# Altium schematic sheet LAN9254_C_P1.SchDoc
size 431 x 279 mm; DocumentNumber: 14; SheetNumber: 8; SheetTotal: 13
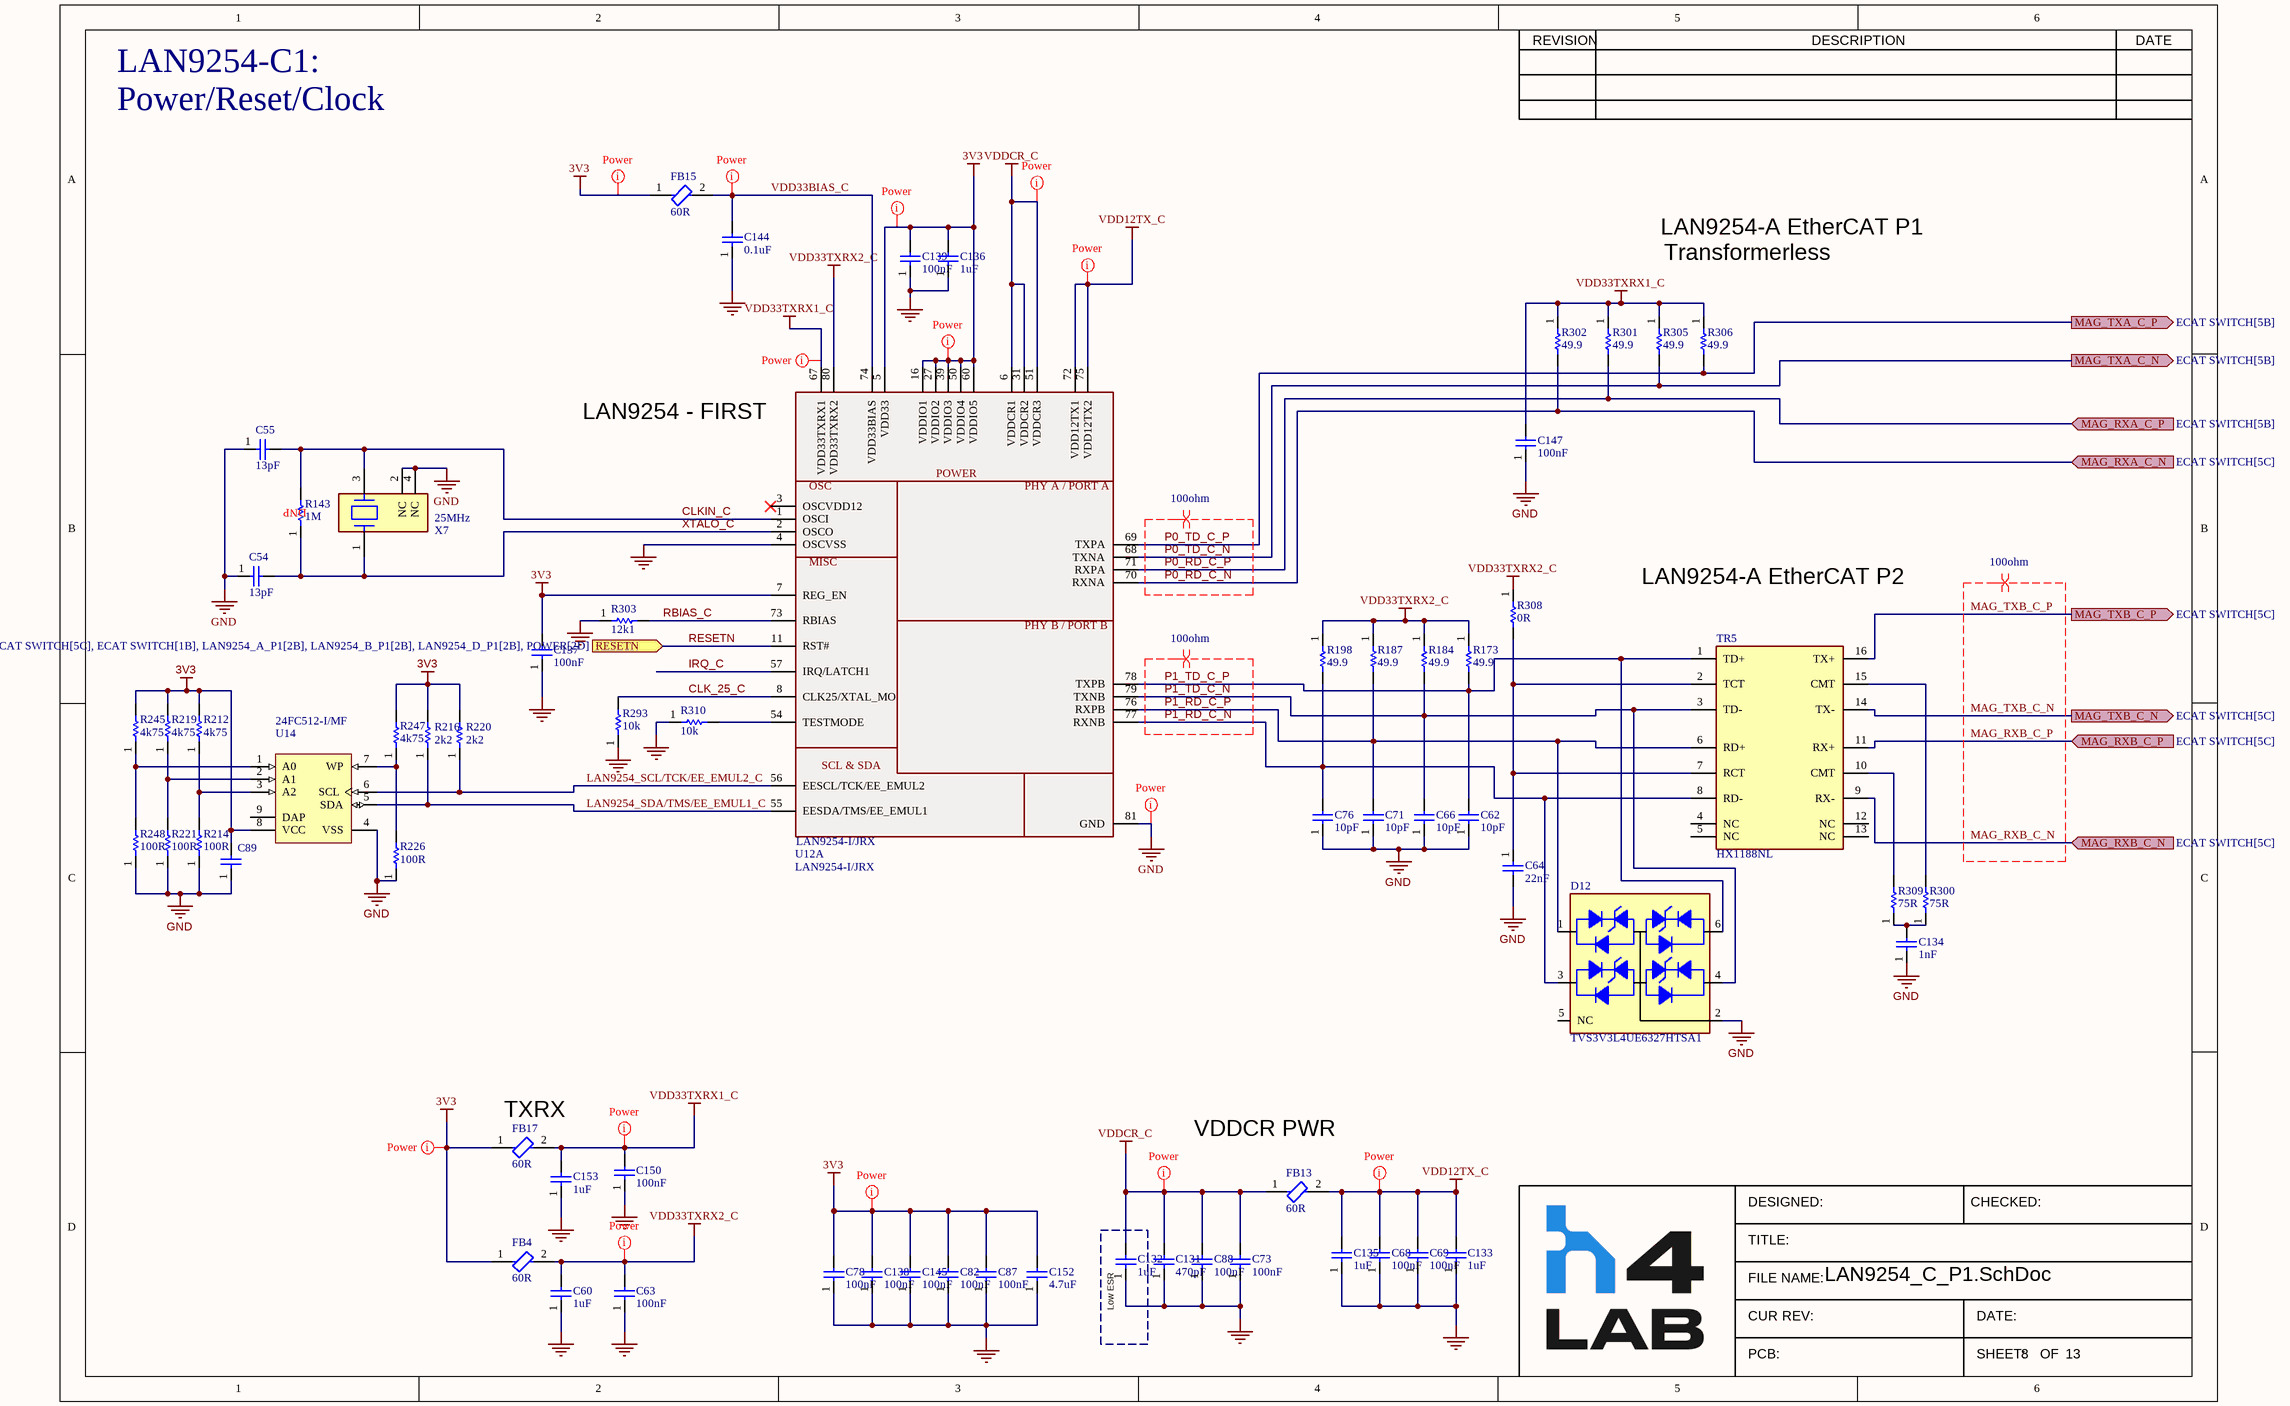
[diagram p0: LAN9254_C_P1.SchDoc]

## Parts
C54  value 13pF  [0402_C]  (hidden comment: GRM0225C1H130GA03L)
C55  value 13pF  [0402_C]  (hidden comment: GRM0225C1H130GA03L)
C60  value 1uF  [CAPC1608X09N(0603)]  (hidden comment: C0603C105K3PACTU)
C62  value 10pF  [0402_C]  (hidden comment: C0402C100J5GAC7411)
C63  value 100nF  [CAPC1005X03N(0402)]  (hidden comment: GRM155R71C104JA88D)
C64  value 22nF  [CAPC1005X03N(0402)]  (hidden comment: GCM155R71H223KA55D)
C66  value 10pF  [0402_C]  (hidden comment: C0402C100J5GAC7411)
C68  value 100nF  [CAPC1005X03N(0402)]  (hidden comment: GRM155R71C104JA88D)
C69  value 100nF  [CAPC1005X03N(0402)]  (hidden comment: GRM155R71C104JA88D)
C71  value 10pF  [0402_C]  (hidden comment: C0402C100J5GAC7411)
C73  value 100nF  [CAPC1005X03N(0402)]  (hidden comment: GRM155R71C104JA88D)
C76  value 10pF  [0402_C]  (hidden comment: C0402C100J5GAC7411)
C78  value 100nF  [CAPC1005X03N(0402)]  (hidden comment: GRM155R71C104JA88D)
C82  value 100nF  [CAPC1005X03N(0402)]  (hidden comment: GRM155R71C104JA88D)
C87  value 100nF  [CAPC1005X03N(0402)]  (hidden comment: GRM155R71C104JA88D)
C88  value 100nF  [CAPC1005X03N(0402)]  (hidden comment: GRM155R71C104JA88D)
C89  GRM155R71C104JA88D  [CAPC1005X03N(0402)]  (value not drawn)
C131  value 470pF  [CAPC1005X03N(0402)]  (hidden comment: GCM1555C1H471JA16D)
C132  value 1uF  [0603_C]  (hidden comment: LMK107BJ105KA-T)
C133  value 1uF  [CAPC1608X09N(0603)]  (hidden comment: C0603C105K3PACTU)
C134  value 1nF  [CAPC3216X16N(1206)]  (hidden comment: CC1206KKX7RDBB102)
C135  value 1uF  [CAPC1608X09N(0603)]  (hidden comment: C0603C105K3PACTU)
C136  value 1uF  [0603_C]  (hidden comment: LMK107BJ105KA-T)
C137  value 100nF  [CAPC1005X03N(0402)]  (hidden comment: GRM155R71C104JA88D)
C138  value 100nF  [CAPC1005X03N(0402)]  (hidden comment: GRM155R71C104JA88D)
C139  value 100nF  [CAPC1005X03N(0402)]  (hidden comment: GRM155R71C104JA88D)
C144  value 0.1uF  [CAPC1608X09N(0603)]  (hidden comment: CL10B104KC8NNNC)
C145  value 100nF  [CAPC1005X03N(0402)]  (hidden comment: GRM155R71C104JA88D)
C147  value 100nF  [CAPC1005X03N(0402)]  (hidden comment: GRM155R71C104JA88D)
C150  value 100nF  [CAPC1005X03N(0402)]  (hidden comment: GRM155R71C104JA88D)
C152  value 4.7uF  [CAPC3216X16N(1206)]  (hidden comment: CL31B475KBHNNNE)
C153  value 1uF  [CAPC1608X09N(0603)]  (hidden comment: C0603C105K3PACTU)
D12  TVS3V3L4UE6327HTSA1  [FP-SOT457-MFG]
FB4  Impedance: 60R  [FP-BKP2125-IPC_C]  (hidden comment: BKP2125HS600-T)
FB13  Impedance: 60R  [FP-BKP2125-IPC_C]  (hidden comment: BKP2125HS600-T)
FB15  Impedance: 60R  [FP-BKP2125-IPC_C]  (hidden comment: BKP2125HS600-T)
FB17  Impedance: 60R  [FP-BKP2125-IPC_C]  (hidden comment: BKP2125HS600-T)
R143  value 1M  [RESC1608X09N(0603)]  (hidden comment: RC0603FR-071ML)
R173  value 49.9  [RESC1005X06N(0402)]  (hidden comment: CRCW040249R9FKED)
R184  value 49.9  [RESC1005X06N(0402)]  (hidden comment: CRCW040249R9FKED)
R187  value 49.9  [RESC1005X06N(0402)]  (hidden comment: CRCW040249R9FKED)
R198  value 49.9  [RESC1005X06N(0402)]  (hidden comment: CRCW040249R9FKED)
R212  value 4k75  [RESC1005X06N(0402)]  (hidden comment: RC0402FR-074K75L)
R214  value 100R  [0402]  (hidden comment: CRGCQ0402F100R)
R216  value 2k2  [0402]  (hidden comment: CRCW04022K20JNED)
R219  value 4k75  [RESC1005X06N(0402)]  (hidden comment: RC0402FR-074K75L)
R220  value 2k2  [0402]  (hidden comment: CRCW04022K20JNED)
R221  value 100R  [0402]  (hidden comment: CRGCQ0402F100R)
R226  value 100R  [0402]  (hidden comment: CRGCQ0402F100R)
R245  value 4k75  [RESC1005X06N(0402)]  (hidden comment: RC0402FR-074K75L)
R247  value 4k75  [RESC1005X06N(0402)]  (hidden comment: RC0402FR-074K75L)
R248  value 100R  [0402]  (hidden comment: CRGCQ0402F100R)
R293  value 10k  [RESC1005X06N(0402)]  (hidden comment: RC0402FR-0710KL)
R300  value 75R  [RESC1005X06N(0402)]  (hidden comment: CRCW040275R0FKEDC)
R301  value 49.9  [RESC1005X06N(0402)]  (hidden comment: CRCW040249R9FKED)
R302  value 49.9  [RESC1005X06N(0402)]  (hidden comment: CRCW040249R9FKED)
R303  value 12k1  [RESC1005X06N(0402)]  (hidden comment: RC0402FR-0712K1L)
R305  value 49.9  [RESC1005X06N(0402)]  (hidden comment: CRCW040249R9FKED)
R306  value 49.9  [RESC1005X06N(0402)]  (hidden comment: CRCW040249R9FKED)
R308  value 0R  [0402]  (hidden comment: RCS04020000Z0ED)
R309  value 75R  [RESC1005X06N(0402)]  (hidden comment: CRCW040275R0FKEDC)
R310  value 10k  [RESC1005X06N(0402)]  (hidden comment: RC0402FR-0710KL)
TR5  HX1188NL  [FP-HX1188NL-MFG]
U12  LAN9254-I/JRX  [QFP50P1400X1400X120-81N]  (part A of 2)
U14  24FC512-I/MF  [DFNS-MF8]
X7  Frequency: 25MHz  [FP-XRCGB-MFG]  (hidden comment: XRCGB25M000F3A00R0)

## Blocks framed on the sheet
Low ESR: C132

## Ports
MAG_RXA_C_N (in, see ECAT SWITCH[5C]), MAG_RXA_C_P (in, see ECAT SWITCH[5B]), MAG_RXB_C_N (in, see ECAT SWITCH[5C]), MAG_RXB_C_P (in, see ECAT SWITCH[5C]), MAG_TXA_C_N (out, see ECAT SWITCH[5B]), MAG_TXA_C_P (out, see ECAT SWITCH[5B]), MAG_TXB_C_N (out, see ECAT SWITCH[5C]), MAG_TXB_C_P (out, see ECAT SWITCH[5C]), RESETN (in, see ECAT SWITCH[5C], ECAT SWITCH[1B], LAN9254_A_P1[2B], LAN9254_B_P1[2B], LAN9254_D_P1[2B], POWER[2D])

## Nets
3V3: C78.2 C82.2 C87.2 C89.2 C136.2 C137.2 C138.2 C139.2 C145.2 C152.2 FB4.1 FB15.1 FB17.1 R212.2 R216.2 R219.2 R220.2 R245.2 R247.2 U12.5(VDD33) U12.7(REG_EN) U12.16(VDDIO1) U12.27(VDDIO2) U12.39(VDDIO3) U12.50(VDDIO4) U12.60(VDDIO5) U14.8(VCC)
GND: C54.1 C55.1 C60.1 C62.1 C63.1 C64.2 C66.1 C68.1 C69.1 C71.1 C73.1 C76.1 C78.1 C82.1 C87.1 C88.1 C89.1 C131.1 C132.1 C133.1 C134.1 C135.1 C136.1 C137.1 C138.1 C139.1 C144.1 C145.1 C147.1 C150.1 C152.1 C153.1 D12.2(GND) R214.1 R221.1 R226.1 R248.1 R293.1 R303.1 R310.1 U12.4(OSCVSS) U12.81(GND) U14.4(VSS) X7.2(NC) X7.4(NC)
VDD12TX_C: C68.2 C69.2 C133.2 C135.2 FB13.2 U12.72(VDD12TX1) U12.75(VDD12TX2)
VDD33TXRX1_C: C147.2 C150.2 C153.2 FB17.2 R301.1 R302.1 R305.1 R306.1 U12.67(VDD33TXRX1)
VDD33TXRX2_C: C60.2 C63.2 FB4.2 R173.1 R184.1 R187.1 R198.1 R308.1 U12.80(VDD33TXRX2)
VDDCR_C: C73.2 C88.2 C131.2 C132.2 FB13.1 U12.6(VDDCR1) U12.31(VDDCR2) U12.51(VDDCR3)
CLK_25_C: R293.2 U12.8(CLK25/XTAL_MO)
CLKIN_C: C55.2 R143.2 U12.1(OSCI) X7.3
IRQ_C: U12.57(IRQ/LATCH1)
LAN9254_SCL/TCK/EE_EMUL2_C: R220.1 U12.56(EESCL/TCK/EE_EMUL2) U14.6(SCL)
LAN9254_SDA/TMS/EE_EMUL1_C: R216.1 U12.55(EESDA/TMS/EE_EMUL1) U14.5(SDA)
MAG_RXB_C_N: TR5.9(RX-) ; port MAG_RXB_C_N
MAG_RXB_C_P: TR5.11(RX+) ; port MAG_RXB_C_P
MAG_TXB_C_N: TR5.14(TX-) ; port MAG_TXB_C_N
MAG_TXB_C_P: TR5.16(TX+) ; port MAG_TXB_C_P
P0_RD_C_N: R302.2 U12.70(RXNA) ; port MAG_RXA_C_N
P0_RD_C_P: R301.2 U12.71(RXPA) ; port MAG_RXA_C_P
P0_TD_C_N: R305.2 U12.68(TXNA) ; port MAG_TXA_C_N
P0_TD_C_P: R306.2 U12.69(TXPA) ; port MAG_TXA_C_P
P1_RD_C_N: C76.2 D12.3 R198.2 TR5.8(RD-) U12.77(RXNB)
P1_RD_C_P: C71.2 D12.1 R187.2 TR5.6(RD+) U12.76(RXPB)
P1_TD_C_N: C66.2 D12.4 R184.2 TR5.3(TD-) U12.79(TXNB)
P1_TD_C_P: C62.2 D12.6 R173.2 TR5.1(TD+) U12.78(TXPB)
RBIAS_C: R303.2 U12.73(RBIAS)
RESETN: U12.11(RST#) ; port RESETN
VDD33BIAS_C: C144.2 FB15.2 U12.74(VDD33BIAS)
XTALO_C: C54.2 R143.1 U12.2(OSCO) X7.1
NetC64_1: C64.1 R308.2 TR5.2(TCT) TR5.7(RCT)
NetC134_2: C134.2 R300.1 R309.1
NetR212_1: R212.1 R214.2 U14.3(A2)
NetR219_1: R219.1 R221.2 U14.2(A1)
NetR226_2: R226.2 R247.1 U14.7(WP)
NetR245_1: R245.1 R248.2 U14.1(A0)
NetR300_2: R300.2 TR5.15(CMT)
NetR309_2: R309.2 TR5.10(CMT)
NetR310_2: R310.2 U12.54(TESTMODE)

Not connected (* = marked no-connect by the designer): D12 5(NC); TR5 4(NC) 5(NC) 12(NC) 13(NC); U12 3(OSCVDD12)*; U14 9(DAP)

## Layout directives
net class Power: 3V3, GND, VDD12TX_C, VDD33BIAS_C, VDD33TXRX1_C, VDD33TXRX2_C, VDDCR_C
differential pair; differential pair class 100ohm: MAG_RXB_C_N, MAG_RXB_C_P, MAG_TXB_C_N, MAG_TXB_C_P, P0_RD_C_N, P0_RD_C_P, P0_TD_C_N, P0_TD_C_P, P1_RD_C_N, P1_RD_C_P, P1_TD_C_N, P1_TD_C_P

## Notes on the sheet
- LAN9254-C1:
- Power/Reset/Clock
- Transformerless
- LAN9254-A EtherCAT P1
- (near U12) LAN9254 - FIRST
- (near R143) DNP
- LAN9254-A EtherCAT P2
- (near FB17) TXRX
- VDDCR PWR
- REVISION
- DESCRIPTION
- DATE
- DESIGNED:
- CHECKED:
- TITLE:
- FILE NAME:
- CUR REV:
- PCB:
- SHEET:
- DATE:
- OF
- (in symbol LAN9254-I/JRX, part A) POWER; OSC; PHY A / PORT A; MISC; PHY B / PORT B; SCL & SDA

## Library data of the parts
C54 C55 = 13pF_50V_0402_CAP_GRM0225C1H130GA03L: Cap Ceramic Monolithic 13pF 50VDC 2% SMD Emboss T/R; Manufacturer: Murata; Supplier 1: Digi-Key; Manufacturer Part Number: GRM0225C1H130GA03L; RoHS: Yes; Category: Ceramic Capacitors; Pricing 1: 40000=0.01108 (USD); RoHS Compliant: Yes; Supplier Part Number 1: 490-GRM0225C1H130GA03LTR-ND
C60 C133 C135 C153 = 1uF_25VDC_0603_Cap: MLCC - SMD/SMT 25volts 1uF X5R 10%; Voltage: 25VDC; Drawn By: TC; MPN: C0603C105K3PACTU; Tolerance: 10%; Supplier 1: Mouser; Supplier Part Number 1: 80-C0603C105K3PAC
C62 C66 C71 C76 = 10pF_50V_0402_C0402C100J5GAC7411: Cap Ceramic 10pF 50V C0G 5% SMD 0402 125°C Punched Paper T/R; Manufacturer: KEMET; Tolerance: 5%; Supplier 1: Digi-Key; Supplier Part Number 1: 399-C0402C100J5GAC7411CT-ND; Manufacturer Part Number: C0402C100J5GAC7411; RoHS: Yes; Category: Ceramic Capacitors; Stock 1: 39987; Pricing 1: 1=0.10000, 10=0.03500, 50=0.01940, 100=0.01580, 500=0.01128, 1000=0.00886, 2500=0.00805, 5000=0.00741 (USD); Case/Package: 0402; Dielectric Material: Ceramic; Min Operating Temperature: -55°C; Max Operating Temperature: 125°C; Packaging: Tape and Reel; Capacitance: 10pF; Dielectric: C0G; Voltage Rating (DC): 50V; Length: 1mm; Depth: 0.5mm; Lead Free: Lead Free; RoHS Compliant: Yes; ComponentLink1URL: http://components.arrow.com/part/dataview/0323_00309912?src-supplier=Arrow+Europe; ComponentLink1Description: http://components.arrow.com/part/dataview/0323_00309912?src-supplier=Arrow+Europe
C63 C68 C69 C73 C78 C82 C87 C88 C137-C139 C145 C147 C150 = 100nF_16V_0402_CAP: CAP CER 0.1UF 16V X7R 0402; Tolerance: 5%; MPN: GRM155R71C104JA88D; Voltage Rating: 16V; Temp Coeff: X7R; Size/Package: 0402
C64 = 22nF_50V_0402_CAP: CAP CER 0.022UF 50V X7R 0402; Tolerance: 10%; MPN: GCM155R71H223KA55D; Voltage Rating: 50V; Temp Coeff: X7R; Size/Package: 0402; Mounting Type: Surface Mounting
C89 = 100nF_16V_0402_CAP: CAP CER 0.1UF 16V X7R 0402; Value: 100nF; Tolerance: 5%; MPN: GRM155R71C104JA88D; Voltage Rating: 16V; Temp Coeff: X7R; Size/Package: 0402
C131 = 470pF_50V_0402_CAP: CAP CER 470PF 50V C0G/NP0 0402; Tolerance: 5%; Temp Coeff: C0G, NP0; MPN: GCM1555C1H471JA16D; Voltage: 50V; Size: 0402
C132 C136 = 1uF_10V_low_ESR_0603_LMK107BJ105KA-T: Multilayer Ceramic Capacitors (High dielectric type), 10V, 1 uF, ± 10 %, 0603, X5R, RoHS; Manufacturer: Taiyo Yuden; Tolerance: 10%; Supplier 1: Digi-Key; Supplier Part Number 1: 587-4281-1-ND; Manufacturer Part Number: LMK107BJ105KA-T; RoHS: Yes; Category: Ceramic Capacitors; Stock 1: 254397; Pricing 1: 1=0.10000, 10=0.05800, 50=0.03180, 100=0.02590, 500=0.01852, 1000=0.01455 (USD); Mount: Surface Mount; Case/Package: 0603; Case Code (Imperial): 0603; Case Code (Metric): 1608; Min Operating Temperature: -55°C; Max Operating Temperature: 85°C; Packaging: Tape and Reel; Capacitance: 1uF; Voltage Rating (DC): 10V; Dielectric: X5R; Package Quantity: 4000; Voltage Rating: 10V; Termination: SMD/SMT; Resistor Type: Ceramic; Series: M; Construction: Flat; Length: 1.6mm; Width: 0.8mm; Height: 0.8mm; Thickness: 0.035inch; Depth: 0.8mm; Radiation Hardening: No; Lead Free: Lead Free; Halogen Free: Halogen Free; RoHS Compliant: Yes; ComponentLink1URL: https://datasheet.ciiva.com/11596/lmk107bj105ka-t-ss-11596793.pdf?src-supplier=Avnet; ComponentLink1Description: https://datasheet.ciiva.com/11596/lmk107bj105ka-t-ss-11596793.pdf?src-supplier=Avnet; ComponentLink2URL: https://datasheet.ciiva.com/15921/1054lmk107bj105ka-t-15921296.pdf?src-supplier=Onlinecomponents.com; ComponentLink2Description: https://datasheet.ciiva.com/15921/1054lmk107bj105ka-t-15921296.pdf?src-supplier=Onlinecomponents.com; ComponentLink3URL: https://datasheet.ciiva.com/26872/getdatasheetpartid-637529-26872638.pdf?src-supplier=Verical; ComponentLink3Description: https://datasheet.ciiva.com/26872/getdatasheetpartid-637529-26872638.pdf?src-supplier=Verical; ComponentLink4URL: https://datasheet.ciiva.com/30232/584lmk107bj105ka-t-30232760.pdf?src-supplier=Onlinecomponents.com; ComponentLink4Description: https://datasheet.ciiva.com/30232/584lmk107bj105ka-t-30232760.pdf?src-supplier=Onlinecomponents.com
C134 = 1nF_2kV_1206_CAP: CAP CER 1000PF 2KV X7R 1206; Tolerance: 10%; Voltage Rating: 2kV; MPN: CC1206KKX7RDBB102; Temp Coeff: X7R; Size/Package: 1206
C144 = 0.1uF_100V_0603_CAP: CAP CER 0.1UF 100V X7R 0603; Tolerance: 10%; MPN: CL10B104KC8NNNC; Supplier 1: Digi-Key; Supplier Part Number 1: 1276-6807-1-ND; Volage Rating: 100V; Temp Coefficent: X7R; Mounting Type: Surface Mount; Case/Package: 0603
C152 = 4.7uF_50V_1206_CAP: CAP CER 4.7UF 50V X7R 1206; Tolerance: 10%; MPN: CL31B475KBHNNNE; Voltage: 50V; Temp Coeff: X7R; Package/Case: 1206
D12 = TVS_DIODE_ETHERCAT_PHY_7.7V_20A_TVS3V3L4UE6327HTSA1: Trans Voltage Suppressor Diode, 3.3V V(RWM), Unidirectional, 4 Element, Silicon; Manufacturer: Infineon; Supplier: Digi-Key; Supplier Part Number: TVS3V3L4UE6327HTSA1CT-ND; Manufacturer Part Number: TVS3V3L4UE6327HTSA1; RoHS: Yes; Category: Diodes; Stock: 273244; Pricing: 1=0.54, 10=0.438, 100=0.2981, 500=0.22356, 1000=0.16767 (USD); Terminal Finish: Tin; Diode Type: TRANS VOLTAGE SUPPRESSOR; Moisture Sensitivity Level: 1; JESD-609 Code: e3; Reach SVHC Compliant: Yes; RoHS Compliant: Yes; ComponentLink1URL: https://datasheet.ciiva.com:443/pdfs/VipMasterIC/IC/INFN/INFNS19177/INFNS19177-1.pdf?src-supplier=IHS+Markit; ComponentLink1Description: https://datasheet.ciiva.com:443/pdfs/VipMasterIC/IC/INFN/INFNS19177/INFNS19177-1.pdf?src-supplier=IHS+Markit; ComponentLink2URL: http://www.farnell.com/datasheets/1945807.pdf?src-supplier=Farnell; ComponentLink2Description: http://www.farnell.com/datasheets/1945807.pdf?src-supplier=Farnell; ComponentLink3URL: http://www.mouser.com/ds/2/196/Infineon-TVS3V3L4U-DS-v02_04-en-469488.pdf?src-supplier=Mouser; ComponentLink3Description: http://www.mouser.com/ds/2/196/Infineon-TVS3V3L4U-DS-v02_04-en-469488.pdf?src-supplier=Mouser; ComponentLink4URL: http://www.farnell.com/datasheets/1945807.pdf?src-supplier=Element14; ComponentLink4Description: http://www.farnell.com/datasheets/1945807.pdf?src-supplier=Element14; ComponentLink5URL: http://www.farnell.com/datasheets/1945807.pdf?src-supplier=Newark; ComponentLink5Description: http://www.farnell.com/datasheets/1945807.pdf?src-supplier=Newark; ComponentLink6URL: http://www.infineon.com/dgdl/Infineon-TVS3V3L4U-DS-v02_04-en.pdf?fileId=db3a3043382e837301385be7912532ed&src-supplier=Avnet; ComponentLink6Description: http://www.infineon.com/dgdl/Infineon-TVS3V3L4U-DS-v02_04-en.pdf?fileId=db3a3043382e837301385be7912532ed&src-supplier=Avnet; ComponentLink7URL: https://www.infineon.com/dgdl/TVS3V3L4U_rev_2_2.pdf?folderId=db3a30431f848401011fcbf2ab4c04c4&fileId=db3a3043382e837301385be7912532ed&src-supplier=Digi-Key; ComponentLink7Description: https://www.infineon.com/dgdl/TVS3V3L4U_rev_2_2.pdf?folderId=db3a30431f848401011fcbf2ab4c04c4&fileId=db3a3043382e837301385be7912532ed&src-supplier=Digi-Key; ComponentLink8URL: https://www.infineon.com/dgdl/TVS3V3L4U_rev_2_2.pdf?folderId=db3a30431f848401011fcbf2ab4c04c4&amp;fileId=db3a3043382e837301385be7912532ed&src-supplier=Digi-Key; ComponentLink8Description: https://www.infineon.com/dgdl/TVS3V3L4U_rev_2_2.pdf?folderId=db3a30431f848401011fcbf2ab4c04c4&amp;fileId=db3a3043382e837301385be7912532ed&src-supplier=Digi-Key
FB4 FB13 FB15 FB17 = 60R_100Mhz_0805_3A: TAIYO YUDEN - BKP2125HS600-T - Ferrite Bead, 0805 [2012 Metric], 60 ohm, 3 A, BKP Series, 0.025 ohm, ± 25%; Max DC Current: 3A; Number of Lines: 1; DC Resistance (DCR): 25mR; Test Frequency: 100MHz; Shielding: Unshielded; Packaging: Tape and Reel; Case Code (Imperial): 0805; Series: BK; Package Quantity: 1; Tolerance: 25%; Lead Free: Lead Free; Number of Pins: 2; Max Current Rating: 3A; Length: 2.3mm; Case/Package: 0805; Max Operating Temperature: 85°C; Min Operating Temperature: -55°C; Core Material: Ferrite; Case Code (Metric): 2125; Depth: 1.45mm; Resistance: 25mR; Halogen Free: Halogen Free; Termination: SMD/SMT; Width: 0.049inch; RoHS Compliant: Yes; Mount: Surface Mount; Height: 1.05mm; Supplier 1: Digi-Key; Manufacturer: Taiyo Yuden; Manufacturer Part Number: BKP2125HS600-T; RoHS: Yes; Category: Inductors; Stock 1: 308405; Pricing 1: 1=0,12000, 10=0,09400, 25=0,08480, 50=0,06200, 100=0,05360, 250=0,04232, 500=0,03574, 1000=0,03010 (USD); REACH SVHC: Unknown; ComponentLink1URL: https://datasheet.ciiva.com/6213/bkp2125hs600-t-ss-6213090.pdf?src-supplier=Digi-Key; ComponentLink1Description: https://datasheet.ciiva.com/6213/bkp2125hs600-t-ss-6213090.pdf?src-supplier=Digi-Key; ComponentLink2URL: https://datasheet.ciiva.com/30063/884bkp2125hs600-t-30063956.pdf?src-supplier=Onlinecomponents.com; ComponentLink2Description: https://datasheet.ciiva.com/30063/884bkp2125hs600-t-30063956.pdf?src-supplier=Onlinecomponents.com; ComponentLink3URL: https://datasheet.ciiva.com/6213/mlci08-e-6213094.pdf?src-supplier=Digi-Key; ComponentLink3Description: https://datasheet.ciiva.com/6213/mlci08-e-6213094.pdf?src-supplier=Digi-Key; ComponentLink4URL: https://datasheet.ciiva.com/6213/mlci08-e-6213097.pdf?src-supplier=Digi-Key; ComponentLink4Description: https://datasheet.ciiva.com/6213/mlci08-e-6213097.pdf?src-supplier=Digi-Key; Supplier Part Number 1: 587-1932-1-ND
R143 = 1M_1/10W_RES_0603: RES SMD 1M OHM 1% 1/10W 0603; MPN: RC0603FR-071ML; Tolerance: 1%; Power: 1/10W; Size: 0603; Supplier 1: Digi-Key; Supplier Part Number 1: 311-1.00MHRCT-ND
R173 R184 R187 R198 R301 R302 R305 R306 = 49R9_1/10W_0402_RES: RES SMD 49.9 OHM 1% 1/16W 0402; MPN: CRCW040249R9FKED; Wattage: 1/16W; Drawn By: TC; Tolerance: 1%; Supplier 1: Digi-Key; Supplier Part Number 1: 541-49.9LCT-ND
R212 R219 R245 R247 = 4k75_1/16_0402_RES: RES SMD 4.75K OHM 1% 1/16W 0402; Power: 1/16; MPN: RC0402FR-074K75L; Tolerance: 1%; Package/Case: 0402
R214 R221 R226 R248 = 100R_1/16_0402_RES: Res Thick Film 0402 100 Ohm 1% 0.063W(1/16W) ±200ppm/C Pad SMD Automotive T/R; Manufacturer: TE Connectivity; Max Power Dissipation: 63mW; Temperature Coefficient: 200ppm/°C; Supplier 1: Digi-Key; Manufacturer Part Number: CRGCQ0402F100R; RoHS: Yes; Category: Chip SMD Resistors; Stock 1: 151133; Pricing 1: 1=0.10000, 10=0.02600, 100=0.01040, 1000=0.00466, 2500=0.00405, 5000=0.00334 (USD); Case/Package: 0402; Case Code (Imperial): 0402; Case Code (Metric): 1005; Min Operating Temperature: -55°C; Max Operating Temperature: 155°C; Resistor Type: Thick Film; Features: Moisture Resistant,Automotive AEC-Q200; Packaging: Cut Tape; Resistance: 100R; Tolerance: 1%; Number of Terminations: 2; RoHS Compliant: Yes; ComponentLink1URL: https://www.te.com/commerce/DocumentDelivery/DDEController?Action=srchrtrv&amp;DocNm=1773204-3&amp;DocType=DS&amp;DocLang=English&src-supplier=Digi-Key; ComponentLink1Description: https://www.te.com/commerce/DocumentDelivery/DDEController?Action=srchrtrv&amp;DocNm=1773204-3&amp;DocType=DS&amp;DocLang=English&src-supplier=Digi-Key; ComponentLink2URL: https://4donline.ihs.com/images/VipMasterIC/IC/TYEL/TYEL-S-A0004929575/TYEL-S-A0004929575-1.pdf?hkey=52A5661711E402568146F3353EA87419&src-supplier=Element14; ComponentLink2Description: https://4donline.ihs.com/images/VipMasterIC/IC/TYEL/TYEL-S-A0004929575/TYEL-S-A0004929575-1.pdf?hkey=52A5661711E402568146F3353EA87419&src-supplier=Element14; ComponentLink3URL: https://4donline.ihs.com/images/VipMasterIC/IC/TYEL/TYEL-S-A0004929575/TYEL-S-A0004929575-1.pdf?hkey=52A5661711E402568146F3353EA87419&src-supplier=Newark; ComponentLink3Description: https://4donline.ihs.com/images/VipMasterIC/IC/TYEL/TYEL-S-A0004929575/TYEL-S-A0004929575-1.pdf?hkey=52A5661711E402568146F3353EA87419&src-supplier=Newark; ComponentLink4URL: https://4donline.ihs.com/images/VipMasterIC/IC/TYEL/TYEL-S-A0004929575/TYEL-S-A0004929575-1.pdf?hkey=52A5661711E402568146F3353EA87419&src-supplier=Farnell; ComponentLink4Description: https://4donline.ihs.com/images/VipMasterIC/IC/TYEL/TYEL-S-A0004929575/TYEL-S-A0004929575-1.pdf?hkey=52A5661711E402568146F3353EA87419&src-supplier=Farnell; Supplier Part Number 1: A129615CT-ND
R216 R220 = 2k2_1/16_0402_CRCW04022K20JNED_RES: Vishay CRCW Series Thick Film Resistor 0402 Case 2.2k 5% 0.063W 200ppm/K; Manufacturer: Vishay Dale; Resistance: 2.2kR; Temperature Coefficient: 200ppm/°C; Max Power Dissipation: 63mW; Voltage Rating: 50V; Tolerance: 5%; Supplier 1: Digi-Key; Manufacturer Part Number: CRCW04022K20JNED; RoHS: Yes; Category: Chip SMD Resistors; Stock 1: 5003; Pricing 1: 1=0,10000, 10=0,03300, 100=0,01360, 1000=0,00610, 2500=0,00529, 5000=0,00437 (USD); Mount: Surface Mount; Case/Package: 0402; Case Code (Imperial): 0402; Case Code (Metric): 1005; Contact Plating: Tin; Weight: 2.3E-05oz; Size Code: 0402; Min Operating Temperature: -55°C; Max Operating Temperature: 155°C; Resistor Type: Thick Film; Packaging: Tape and Reel; Number of Terminations: 2; Power Rating: 63mW; Package Quantity: 1; Features: Automotive AEC-Q200; Termination: SMD/SMT; Voltage Rating (DC): 50V; Series: CRCW; Resistance Tolerance: 5%; Construction: Rectangular; Technology: THICK FILM; Length: 1mm; Width: 0.5mm; Height: 0.35mm; Depth: 0.5mm; Radiation Hardening: No; RoHS Compliant: Yes; Lead Free: Lead Free; REACH SVHC: Unknown; Military Standard: Not; ComponentLink1URL: https://datasheet.ciiva.com/5542/dcrcwe3-109170-5542006.pdf?src-supplier=Mouser; ComponentLink1Description: https://datasheet.ciiva.com/5542/dcrcwe3-109170-5542006.pdf?src-supplier=Mouser; ComponentLink2URL: https://datasheet.ciiva.com/3256/dcrcwe3-3256342.pdf?src-supplier=Avnet; ComponentLink2Description: https://datasheet.ciiva.com/3256/dcrcwe3-3256342.pdf?src-supplier=Avnet; ComponentLink3URL: https://datasheet.ciiva.com/3256/dcrcwe3-3256343.pdf?src-supplier=Avnet; ComponentLink3Description: https://datasheet.ciiva.com/3256/dcrcwe3-3256343.pdf?src-supplier=Avnet; ComponentLink4URL: https://datasheet.ciiva.com/2462/dcrcwe3-2462040.pdf?src-supplier=Digi-Key; ComponentLink4Description: https://datasheet.ciiva.com/2462/dcrcwe3-2462040.pdf?src-supplier=Digi-Key; ComponentLink5URL: https://datasheet.ciiva.com/2462/dcrcwe3-2462041.pdf?src-supplier=Digi-Key; ComponentLink5Description: https://datasheet.ciiva.com/2462/dcrcwe3-2462041.pdf?src-supplier=Digi-Key; ComponentLink6URL: https://datasheet.ciiva.com/2462/dcrcwe3-2462042.pdf?src-supplier=Digi-Key; ComponentLink6Description: https://datasheet.ciiva.com/2462/dcrcwe3-2462042.pdf?src-supplier=Digi-Key; ComponentLink7URL: https://datasheet.ciiva.com/16760/70201119-16760139.pdf?src-supplier=Allied+Electronics; ComponentLink7Description: https://datasheet.ciiva.com/16760/70201119-16760139.pdf?src-supplier=Allied+Electronics; ComponentLink8URL: https://datasheet.ciiva.com/16436/dcrcwe3-16436154.pdf?src-supplier=Future+Electronics; ComponentLink8Description: https://datasheet.ciiva.com/16436/dcrcwe3-16436154.pdf?src-supplier=Future+Electronics; ComponentLink9URL: https://datasheet.ciiva.com/7743/dcrcwe3-7743566.pdf?src-supplier=Element14; ComponentLink9Description: https://datasheet.ciiva.com/7743/dcrcwe3-7743566.pdf?src-supplier=Element14; Supplier Part Number 1: 541-2.2KJCT-ND
R293 R310 = 10k_1/16W_0402_RES: RES SMD 10K OHM 1% 1/16W 0402; Tolerance: 1%; Power: 1/16W; Size: 0402; MPN: RC0402FR-0710KL
R300 R309 = 75R_1/10W_0402_RES: RES SMD 75 OHM 1% 1/16W 0402; Tolerance: +/-1%; MPN: CRCW040275R0FKEDC; Wattage: 1/16W; Drawn By: TC; Size/Package: 0402
R303 = 12k1_1/16W-0402_RES: RES SMD 12.1K OHM 1% 1/16W 0402; MPN: RC0402FR-0712K1L; Tolerance: 1%; Power: 1/16W; Case/Package: 0402
R308 = 0R_1/5W_0402_RCS04020000Z0ED_RES: VISHAY - RCS04020000Z0ED - SMD Chip Resistor, 0402 [1005 Metric], 0 ohm, RCS Series, 50 V, Thick Film, 200 mW; Manufacturer: Vishay Dale; Resistance: 0mR; Max Power Dissipation: 200mW; Supplier 1: Digi-Key; Supplier Part Number 1: 541-2877-1-ND; Manufacturer Part Number: RCS04020000Z0ED; RoHS: Yes; Category: Chip SMD Resistors; Stock 1: 18214; Pricing 1: 1=0.10000, 10=0.08300, 25=0.05760, 50=0.04480, 100=0.03200, 250=0.02496, 500=0.01984, 1000=0.01408, 5000=0.01088 (USD); Case/Package: 0402; Case Code (Metric): 1005; Case Code (Imperial): 0402; Min Operating Temperature: -55°C; Max Operating Temperature: 155°C; Packaging: Tape and Reel; Resistor Type: Thick Film; Number of Terminations: 2; Features: Automotive AEC-Q200; Length: 0.039inch; Width: 0.02inch; Height: 0.016inch; RoHS Compliant: Yes; ComponentLink1URL: http://www.farnell.com/datasheets/2618474.pdf?src-supplier=Farnell; ComponentLink1Description: http://www.farnell.com/datasheets/2618474.pdf?src-supplier=Farnell; ComponentLink2URL: http://www.vishay.com/docs/20065/rcse3.pdf?src-supplier=Digi-Key; ComponentLink2Description: http://www.vishay.com/docs/20065/rcse3.pdf?src-supplier=Digi-Key; ComponentLink3URL: http://www.farnell.com/datasheets/2618474.pdf?src-supplier=Element14; ComponentLink3Description: http://www.farnell.com/datasheets/2618474.pdf?src-supplier=Element14; ComponentLink4URL: http://www.farnell.com/datasheets/2618474.pdf?src-supplier=Newark; ComponentLink4Description: http://www.farnell.com/datasheets/2618474.pdf?src-supplier=Newark
TR5 = HX1188NL_TRANSFO_LAN_-40-85DEG: Datacom Transformer, GENERAL PURPOSE Application(s), 1:1; 1:1; Manufacturer: Pulse; Isolation Voltage: 1.65kV; Channels: 1; Primary Inductance: 350uH; Manufacturer Part Number: HX1188NL; RoHS: Yes; Category: Transformers; Min Operating Temperature: -40°C; Max Operating Temperature: 85°C; Turns Ratio: 1:1; Packaging: Rail/Tube; Length: 12.7mm; Width: 7.11mm; Height: 5.97mm; RoHS Compliant: Yes; ComponentLink1URL: https://datasheet.ciiva.com:443/pdfs/VipMasterIC/IC/PLEI/PLEI-S-A0005794621/PLEI-S-A0005794621-1.pdf?src-supplier=IHS+Markit; ComponentLink1Description: https://datasheet.ciiva.com:443/pdfs/VipMasterIC/IC/PLEI/PLEI-S-A0005794621/PLEI-S-A0005794621-1.pdf?src-supplier=IHS+Markit; Supplier: Digi-Key; Supplier Part Number: 553-1340-5-ND; Stock: 14377; Pricing: 1=5.68, 10=4.314, 25=4.2004, 50=3.86, 100=3.6329, 250=3.5194, 500=3.40588, 1000=3.29234 (USD); Mounting Technology: Surface Mount; Terminal Finish: Nickel; Application(s): GENERAL PURPOSE; Transformer Type: DATACOM TRANSFORMER; JESD-609 Code: e3; Reach SVHC Compliant: Yes; ComponentLink2URL: https://datasheet.ciiva.com/2938/+hj603-2938785.pdf?src-supplier=Digi-Key; ComponentLink2Description: https://datasheet.ciiva.com/2938/+hj603-2938785.pdf?src-supplier=Digi-Key
U12 = LAN9254-I/JRX: 2/3-PORT Ethercat Slave Controller With 32 Digios With Integrated Ethernet Phys; Manufacturer: Microchip; Supplier 1: Digi-Key; Manufacturer Part Number: LAN9254-I/JRX; RoHS: Yes; Pricing 1: 1=14.24000, 25=12.99000 (USD); RoHS Compliant: Yes; Supplier Part Number 1: 150-LAN9254-I/JRX-ND
U14 = EEPROM_512kb_1MHz_24FC512-I/MF: EEPROM Serial-2Wire 512K-bit 64K x 8 1.8V/2.5V/3.3V/5V 8-Pin DFN-S EP Tube; Manufacturer: Microchip; Interface: I2C,Serial; Frequency: 400kHz; Min Supply Voltage: 1.7V; Max Supply Voltage: 5.5V; Access Time: 400ns; Nominal Supply Current: 5mA; Density: 512Kb; Max Frequency: 1MHz; Organization: 64KX8; Access Time-Max: 900ns; Write Protection: YES; Write Cycle Time-Max (tWC): 5ms; Supplier 1: Digi-Key; Manufacturer Part Number: 24FC512-I/MF; RoHS: Yes; Category: EEPROM; Pricing 1: 1=2.16000 (USD); Mount: Surface Mount; Number of Pins: 8; Contact Plating: Tin,Matte; Min Operating Temperature: -40°C; Max Operating Temperature: 85°C; Packaging: Rail/Tube; Memory Type: EEPROM; Package Quantity: 60; Memory Size: 512Kb; Supply Current: 5mA; REACH SVHC: No SVHC; Lead Free: Lead Free; RoHS Compliant: Yes; ComponentLink1URL: https://datasheet.ciiva.com/3185/21754m-3185247.pdf?src-supplier=Avnet; ComponentLink1Description: https://datasheet.ciiva.com/3185/21754m-3185247.pdf?src-supplier=Avnet; Supplier Part Number 1: 24FC512-I/MF-ND; Case/Package: DFN; Programming Voltage: 5.5V; Supply Voltage-Nom: 5.5V; Radiation Hardening: No; ComponentLink2URL: https://datasheet.ciiva.com/16321/filehandler-aspxddocname-en546203-16321085.pdf?src-supplier=Future+Electronics; ComponentLink2Description: https://datasheet.ciiva.com/16321/filehandler-aspxddocname-en546203-16321085.pdf?src-supplier=Future+Electronics
X7 = 25MHz_Crystal_2016_35PPM_XRCGB25M000F3A00R0: Crystal 25MHz ±30ppm (Tol) ±35ppm (Stability) 6pF 100Ohm Automotive 4-Pin SMD T/R; Manufacturer: Murata; ESR (Equivalent Series Resistance): 100R; Frequency Stability: 100ppm; Load Capacitance: 6pF; Supplier 1: Digi-Key; Manufacturer Part Number: XRCGB25M000F3A00R0; RoHS: Yes; Category: Crystals; Stock 1: 53614; Pricing 1: 1=0.56000, 10=0.46300, 50=0.41640, 100=0.37010, 500=0.35156, 1000=0.29605 (USD); Mount: Surface Mount; Case/Package: SMD/SMT; Min Operating Temperature: -40°C; Max Operating Temperature: 125°C; Packaging: Tape and Reel; Frequency Tolerance: 35ppm; Length: 0.079inch; Width: 0.063inch; Height: 0.028inch; Ratings: AEC-Q200; RoHS Compliant: Yes; ComponentLink1URL: http://www.farnell.com/datasheets/2631968.pdf?src-supplier=Farnell; ComponentLink1Description: http://www.farnell.com/datasheets/2631968.pdf?src-supplier=Farnell; ComponentLink2URL: http://www.murata.com/~/media/webrenewal/products/timingdevice/crystalu/flyers/vppt-hcrj126-d.ashx?la=en&src-supplier=Digi-Key; ComponentLink2Description: http://www.murata.com/~/media/webrenewal/products/timingdevice/crystalu/flyers/vppt-hcrj126-d.ashx?la=en&src-supplier=Digi-Key; ComponentLink3URL: https://www.murata.com/~/media/webrenewal/products/timingdevice/crystalu/flyers/vppt-hcrj126-d.ashx?la=en&src-supplier=Digi-Key; ComponentLink3Description: https://www.murata.com/~/media/webrenewal/products/timingdevice/crystalu/flyers/vppt-hcrj126-d.ashx?la=en&src-supplier=Digi-Key; ComponentLink4URL: http://www.farnell.com/datasheets/2631968.pdf?src-supplier=Newark; ComponentLink4Description: http://www.farnell.com/datasheets/2631968.pdf?src-supplier=Newark; Supplier Part Number 1: 490-12146-1-ND